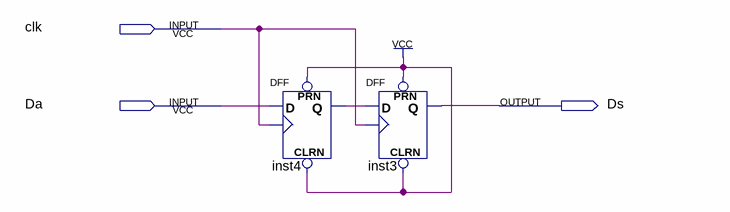
[diagram p0: schematic sheet]
// Quartus schematic sync.bdf as structural Verilog: 2 symbols, 3 pins
module sync (
  input  clk,
  input  Da,
  output Ds
);

  wire inst4_q;

  DFF inst4 (.CLRN(1'b1), .CLK(clk), .D(Da), .PRN(1'b1), .Q(inst4_q));
  DFF inst3 (.CLRN(1'b1), .CLK(clk), .D(inst4_q), .PRN(1'b1), .Q(Ds));
endmodule
